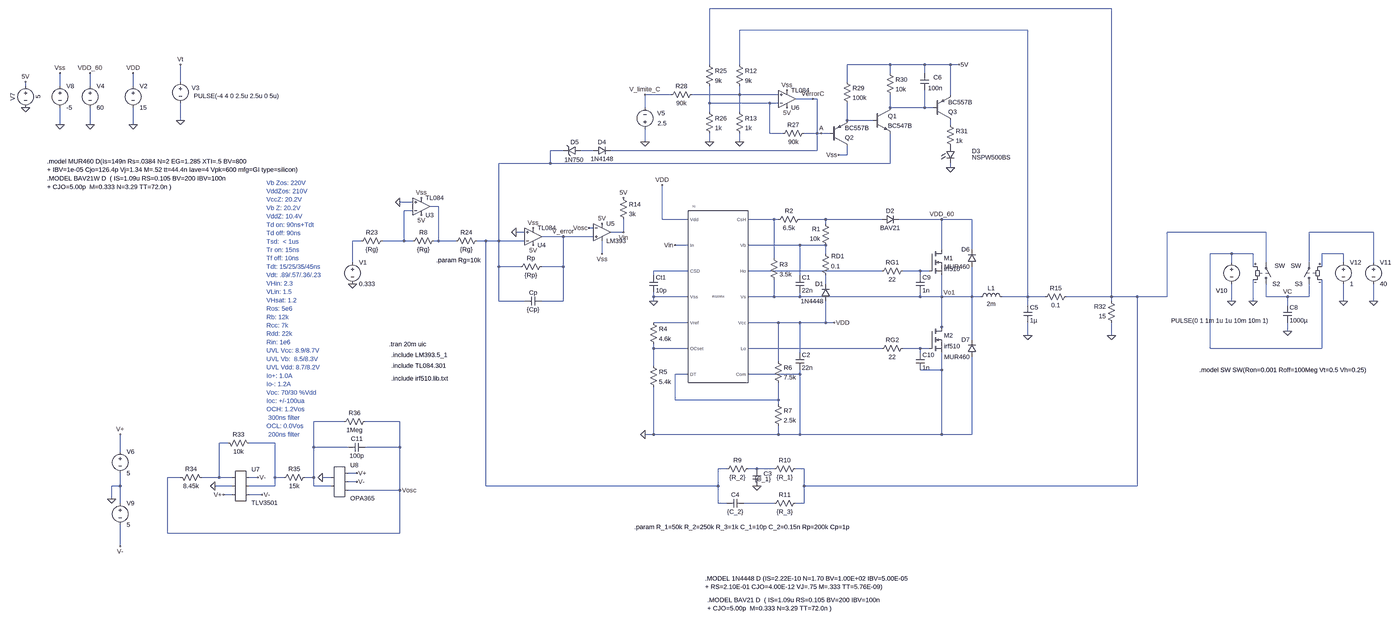
[diagram p0: schematic FINAL FILTRO_con_limitador.asc, whole sheet]
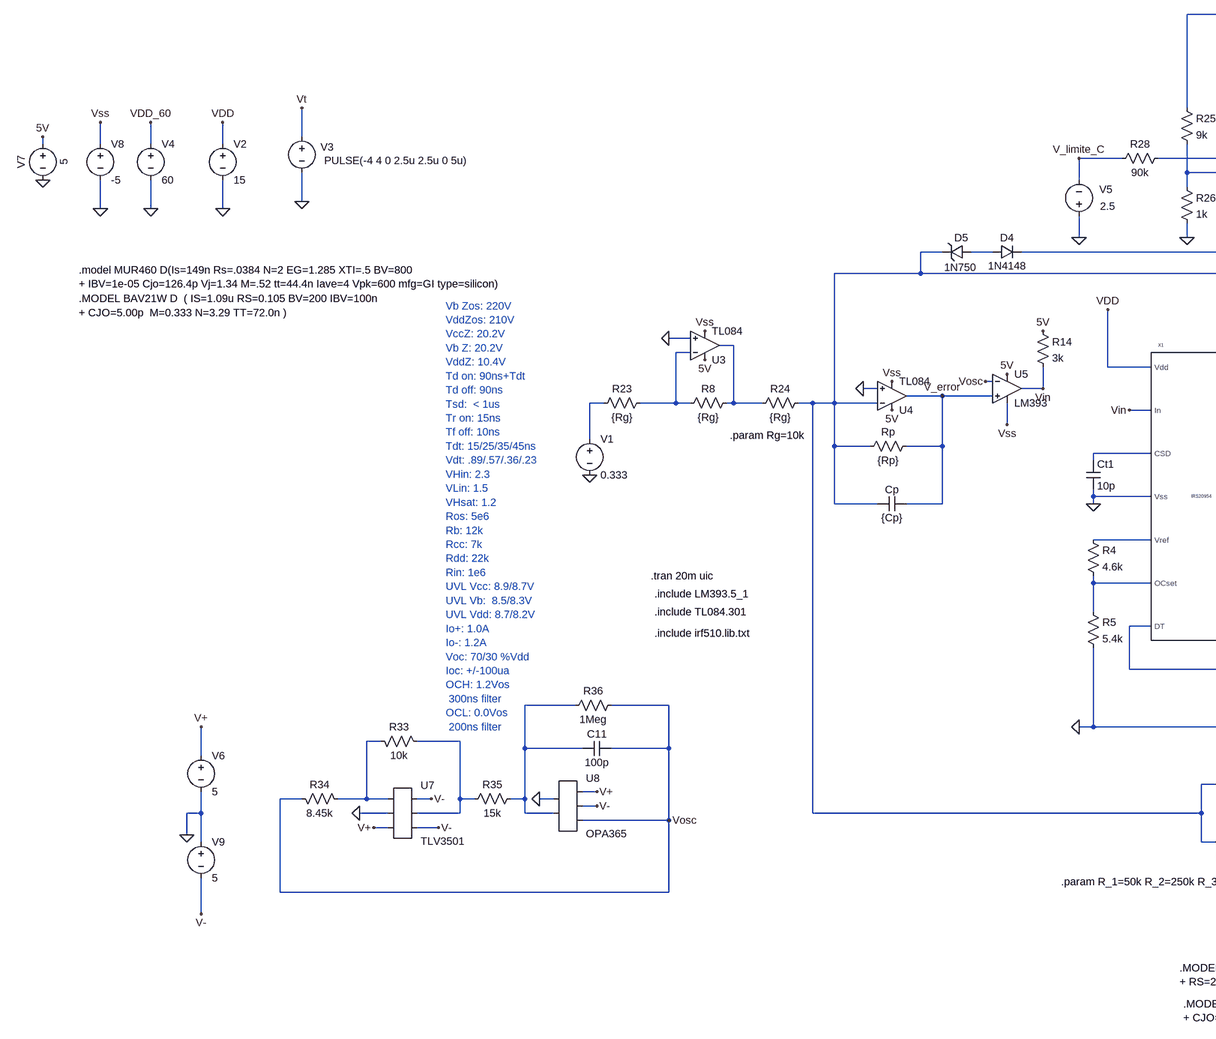
[diagram p1: schematic FINAL FILTRO_con_limitador.asc, part, row 1 of 1, column 1 of 2]
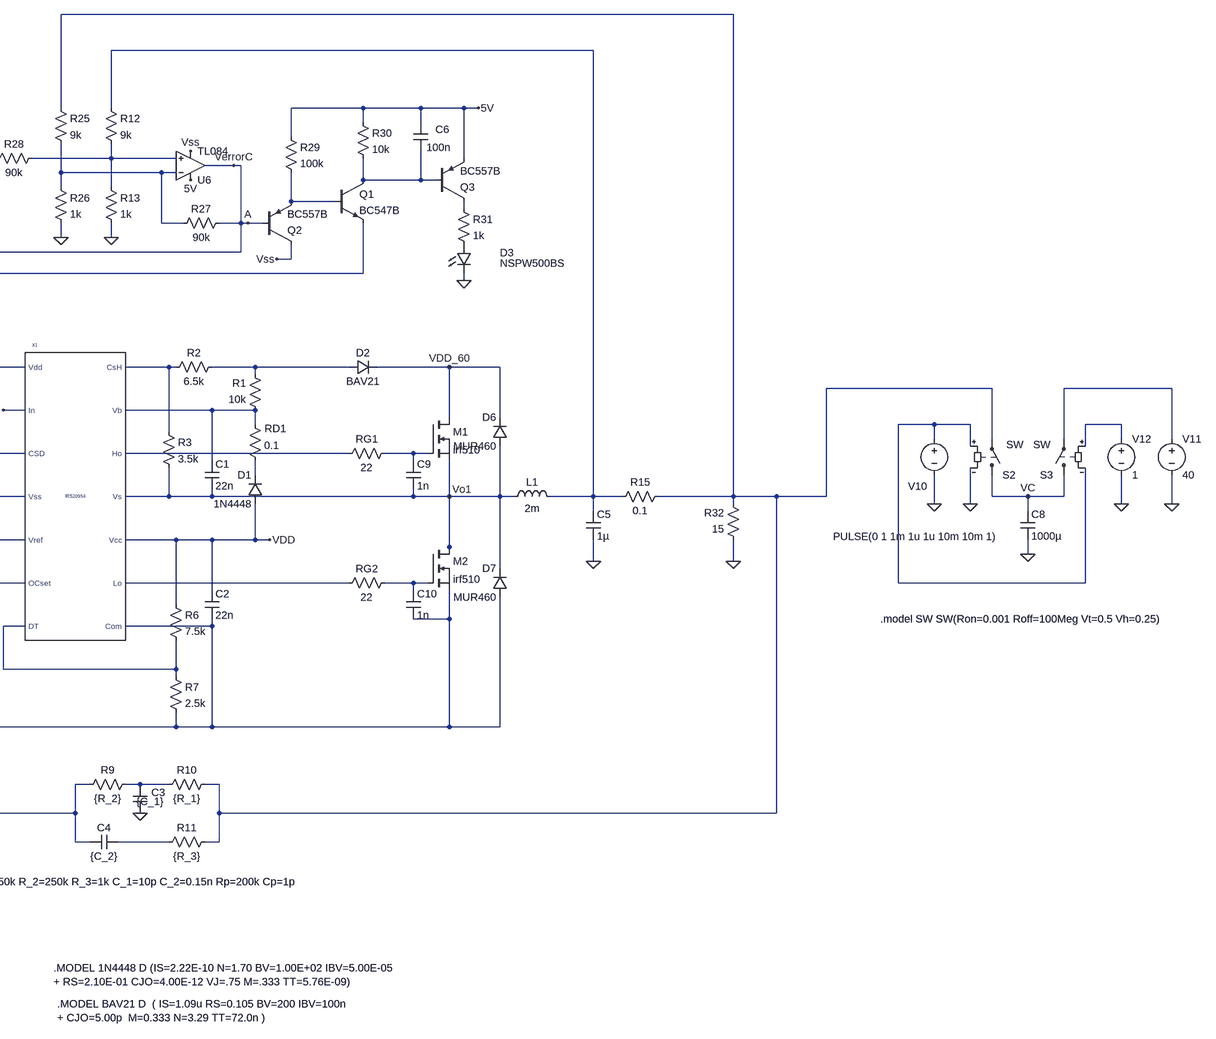
[diagram p2: schematic FINAL FILTRO_con_limitador.asc, part, row 1 of 1, column 2 of 2]
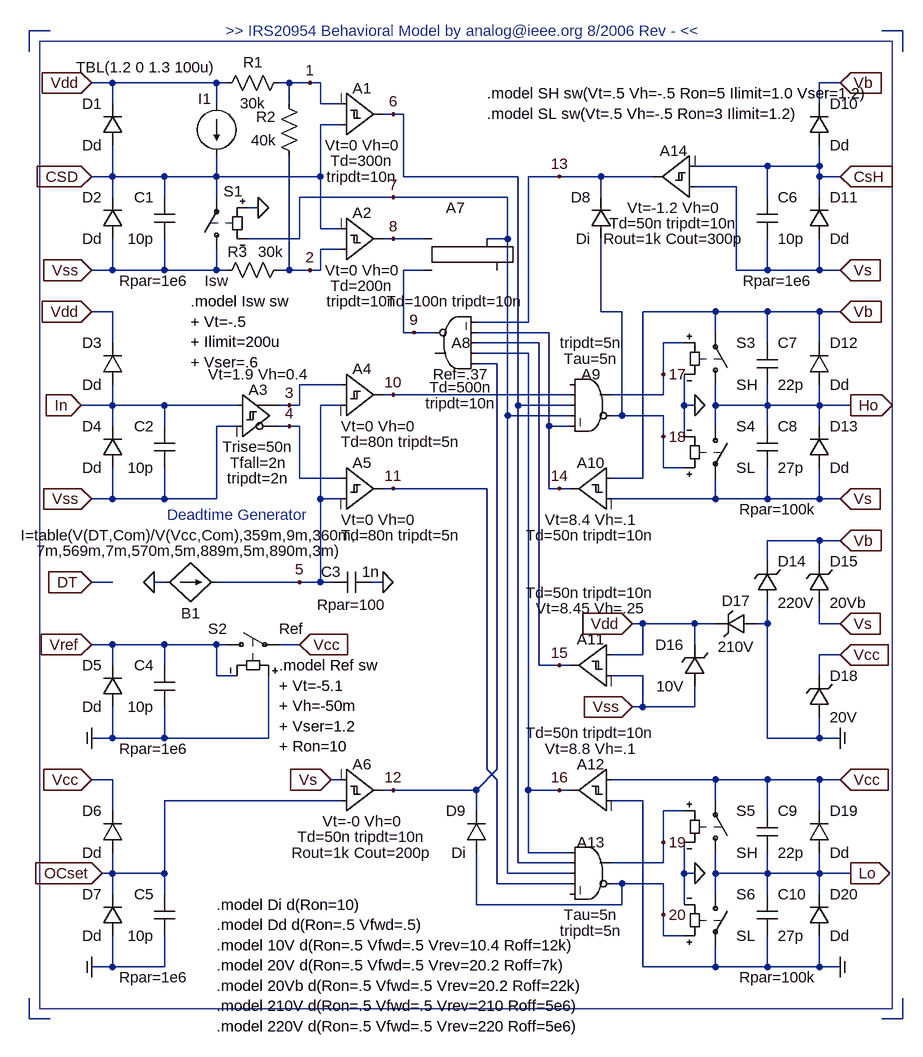
[diagram p3: sub-circuit irs20954.asc]
FINAL FILTRO_con_limitador.asc, the LTspice schematic file:
Version 4
SHEET 1 3216 2012
WIRE 1408 -736 -112 -736
WIRE 1072 -656 0 -656
WIRE -112 -528 -112 -736
WIRE 0 -528 0 -656
WIRE 560 -528 400 -528
WIRE 688 -528 560 -528
WIRE 784 -528 688 -528
WIRE 816 -528 784 -528
WIRE 560 -496 560 -528
WIRE 688 -496 688 -528
WIRE -2080 -464 -2080 -528
WIRE 400 -464 400 -528
WIRE -2656 -448 -2656 -464
WIRE -2528 -448 -2528 -496
WIRE -2416 -448 -2416 -496
WIRE -2256 -448 -2256 -496
WIRE -256 -416 -352 -416
WIRE 0 -416 0 -448
WIRE 0 -416 -176 -416
WIRE 144 -416 0 -416
WIRE 784 -416 784 -528
WIRE 272 -400 208 -400
WIRE 288 -400 272 -400
WIRE -112 -384 -112 -448
WIRE 112 -384 -112 -384
WIRE 144 -384 112 -384
WIRE -352 -368 -352 -416
WIRE 560 -368 560 -416
WIRE 688 -368 688 -432
WIRE 688 -368 560 -368
WIRE 720 -368 688 -368
WIRE -112 -352 -112 -384
WIRE 0 -352 0 -416
WIRE -2080 -320 -2080 -384
WIRE 400 -320 400 -384
WIRE 496 -320 400 -320
WIRE -2528 -304 -2528 -368
WIRE -2416 -304 -2416 -368
WIRE -2256 -304 -2256 -368
WIRE 784 -304 784 -320
WIRE 112 -272 112 -384
WIRE 160 -272 112 -272
WIRE 288 -272 288 -400
WIRE 288 -272 240 -272
WIRE 304 -272 288 -272
WIRE 336 -272 304 -272
WIRE -352 -240 -352 -288
WIRE -112 -240 -112 -272
WIRE 0 -240 0 -272
WIRE -656 -208 -704 -208
WIRE -544 -208 -592 -208
WIRE 288 -208 288 -272
WIRE 288 -208 -480 -208
WIRE 400 -192 400 -224
WIRE 400 -192 368 -192
WIRE -704 -160 -704 -208
WIRE -704 -160 -896 -160
WIRE 560 -160 560 -272
WIRE 560 -160 -704 -160
WIRE 784 -144 784 -160
WIRE -1216 -16 -1264 -16
WIRE -1120 0 -1152 0
WIRE -1216 16 -1248 16
WIRE -288 48 -288 -80
WIRE -192 48 -288 48
WIRE 128 48 32 48
WIRE 144 48 128 48
WIRE 320 48 224 48
WIRE 528 48 320 48
WIRE 752 48 592 48
WIRE 864 48 752 48
WIRE 320 64 320 48
WIRE -544 80 -560 80
WIRE -800 96 -832 96
WIRE -432 96 -432 48
WIRE -432 96 -480 96
WIRE 2128 96 1760 96
WIRE 2528 96 2288 96
WIRE -656 112 -736 112
WIRE -544 112 -656 112
WIRE -1408 128 -1440 128
WIRE -1248 128 -1248 16
WIRE -1248 128 -1328 128
WIRE -1216 128 -1248 128
WIRE -1120 128 -1120 0
WIRE -1120 128 -1136 128
WIRE -1056 128 -1120 128
WIRE -944 128 -976 128
WIRE -896 128 -896 -160
WIRE -896 128 -944 128
WIRE -800 128 -896 128
WIRE -192 144 -240 144
WIRE 224 144 32 144
WIRE 320 144 224 144
WIRE 752 160 752 48
WIRE 864 160 864 48
WIRE -512 176 -512 128
WIRE 320 176 320 144
WIRE 2000 176 1920 176
WIRE 2080 176 2000 176
WIRE 2416 176 2336 176
WIRE 128 192 128 48
WIRE -1440 208 -1440 128
WIRE 2000 208 2000 176
WIRE 2128 208 2128 96
WIRE 2288 208 2288 96
WIRE 2416 208 2416 176
WIRE 2528 208 2528 96
WIRE -896 224 -896 128
WIRE -816 224 -896 224
WIRE -656 224 -656 112
WIRE -656 224 -736 224
WIRE 2080 224 2080 176
WIRE 2336 224 2336 176
WIRE -192 240 -320 240
WIRE 528 240 32 240
WIRE 672 240 608 240
WIRE 704 240 672 240
WIRE -320 256 -320 240
WIRE 224 256 224 144
WIRE 672 256 672 240
WIRE 320 288 320 256
WIRE -320 336 -320 320
WIRE -192 336 -320 336
WIRE 128 336 128 272
WIRE 128 336 32 336
WIRE 224 336 224 320
WIRE 224 336 128 336
WIRE 672 336 672 320
WIRE 672 336 224 336
WIRE 752 336 752 256
WIRE 752 336 672 336
WIRE 864 336 864 224
WIRE 864 336 752 336
WIRE 896 336 864 336
WIRE 1072 336 1072 -656
WIRE 1072 336 976 336
WIRE 1136 336 1072 336
WIRE 1408 336 1408 -736
WIRE 1408 336 1216 336
WIRE 1504 336 1408 336
WIRE 1760 336 1760 96
WIRE 1760 336 1504 336
WIRE 2128 336 2128 288
WIRE 2208 336 2128 336
WIRE 2288 336 2288 288
WIRE 2288 336 2208 336
WIRE -896 352 -896 224
WIRE -800 352 -896 352
WIRE -656 352 -656 224
WIRE -656 352 -736 352
WIRE -320 352 -320 336
WIRE 1408 352 1408 336
WIRE 2000 352 2000 288
WIRE 2080 352 2080 272
WIRE 2416 352 2416 288
WIRE 2528 352 2528 288
WIRE 1072 368 1072 336
WIRE 2208 368 2208 336
WIRE -192 432 -320 432
WIRE 144 432 32 432
WIRE 224 432 144 432
WIRE 320 432 320 352
WIRE 320 432 224 432
WIRE 352 432 320 432
WIRE 752 448 752 336
WIRE 752 464 752 448
WIRE 2208 464 2208 432
WIRE 1072 480 1072 432
WIRE 1408 480 1408 432
WIRE 864 496 864 336
WIRE -320 528 -320 512
WIRE -192 528 -320 528
WIRE 528 528 32 528
WIRE 672 528 608 528
WIRE 704 528 672 528
WIRE 1920 528 1920 176
WIRE 2336 528 2336 272
WIRE 2336 528 1920 528
WIRE 224 544 224 432
WIRE 672 544 672 528
WIRE 144 576 144 432
WIRE -320 592 -320 528
WIRE 752 608 752 544
WIRE 752 608 672 608
WIRE -192 624 -240 624
WIRE 224 624 224 608
WIRE 224 624 32 624
WIRE -240 720 -240 624
WIRE 144 720 144 656
WIRE 144 720 -240 720
WIRE 144 736 144 720
WIRE -1472 800 -1584 800
WIRE -1264 800 -1392 800
WIRE -320 848 -320 672
WIRE -320 848 -352 848
WIRE 144 848 144 816
WIRE 144 848 -320 848
WIRE 224 848 224 624
WIRE 224 848 144 848
WIRE 752 848 752 608
WIRE 752 848 224 848
WIRE 864 848 864 560
WIRE 864 848 752 848
WIRE -1904 880 -1936 880
WIRE -1728 880 -1824 880
WIRE -1584 896 -1584 800
WIRE -1456 896 -1584 896
WIRE -1264 896 -1264 800
WIRE -1264 896 -1392 896
WIRE -2304 912 -2304 848
WIRE -48 976 -80 976
WIRE 64 976 32 976
WIRE 128 976 64 976
WIRE 240 976 208 976
WIRE -1424 992 -1456 992
WIRE -2080 1008 -2128 1008
WIRE -1936 1008 -1936 880
WIRE -1936 1008 -2000 1008
WIRE -1888 1008 -1936 1008
WIRE -1792 1008 -1824 1008
WIRE -1728 1008 -1728 880
WIRE -1696 1008 -1728 1008
WIRE -1584 1008 -1584 896
WIRE -1584 1008 -1616 1008
WIRE -1520 1008 -1552 1008
WIRE -1424 1024 -1456 1024
WIRE -2304 1040 -2304 992
WIRE -2304 1040 -2336 1040
WIRE -1888 1040 -1952 1040
WIRE -1728 1040 -1728 1008
WIRE -1728 1040 -1824 1040
WIRE -1584 1040 -1584 1008
WIRE -1520 1040 -1584 1040
WIRE -944 1040 -944 128
WIRE -80 1040 -80 976
WIRE -80 1040 -944 1040
WIRE 240 1040 240 976
WIRE 1504 1040 1504 336
WIRE 1504 1040 240 1040
WIRE -1264 1056 -1264 896
WIRE -1264 1056 -1456 1056
WIRE -1888 1072 -1920 1072
WIRE -1776 1072 -1824 1072
WIRE -2336 1088 -2336 1040
WIRE -2304 1104 -2304 1040
WIRE -80 1104 -80 1040
WIRE -48 1104 -80 1104
WIRE 128 1104 16 1104
WIRE 240 1104 240 1040
WIRE 240 1104 208 1104
WIRE -2128 1216 -2128 1008
WIRE -1264 1216 -1264 1056
WIRE -1264 1216 -2128 1216
WIRE -2304 1264 -2304 1184
FLAG -2416 -304 0
FLAG -2416 -496 VDD_60
FLAG -2256 -304 0
FLAG -2256 -496 VDD
FLAG 1072 480 0
FLAG -2656 -368 0
FLAG -2528 -304 0
FLAG -2528 -496 Vss
FLAG -2656 -464 5V
FLAG 64 1040 0
FLAG -656 112 V_error
FLAG -768 80 Vss
FLAG -768 144 5V
FLAG -432 96 Vin
FLAG -432 -32 5V
FLAG -512 176 Vss
FLAG -512 64 5V
FLAG -1264 -16 0
FLAG -1184 -32 Vss
FLAG -1184 32 5V
FLAG -352 848 0
FLAG 752 48 VDD_60
FLAG -288 -80 VDD
FLAG -320 352 0
FLAG 752 336 Vo1
FLAG -240 144 Vin
FLAG 352 432 VDD
FLAG -832 96 0
FLAG -1440 288 0
FLAG -2080 -320 0
FLAG -2080 -528 Vt
FLAG 0 -240 0
FLAG -112 -240 0
FLAG 272 -400 VerrorC
FLAG -352 -240 0
FLAG -352 -416 V_limite_C
FLAG 784 -144 0
FLAG 304 -272 A
FLAG 1408 480 0
FLAG 176 -432 Vss
FLAG 176 -368 5V
FLAG 816 -528 5V
FLAG 368 -192 Vss
FLAG 2080 352 0
FLAG 2000 352 0
FLAG 2208 464 0
FLAG 2528 352 0
FLAG 2416 352 0
FLAG 2208 336 VC
FLAG -2336 1088 0
FLAG -2304 848 V+
FLAG -2304 1264 V-
FLAG -1424 992 V+
FLAG -1920 1072 V+
FLAG -1424 1024 V-
FLAG -1952 1040 0
FLAG -1792 1008 V-
FLAG -1552 1008 0
FLAG -1776 1072 V-
FLAG -1264 1056 Vosc
FLAG -560 80 Vosc
SYMBOL voltage -2256 -464 R0
SYMATTR InstName V2
SYMATTR Value 15
SYMBOL voltage -2416 -464 R0
WINDOW 123 0 0 Left 2
WINDOW 39 0 0 Left 2
SYMATTR InstName V4
SYMATTR Value 60
SYMBOL ind 880 352 R270
WINDOW 0 32 56 VTop 2
WINDOW 3 5 56 VBottom 2
SYMATTR InstName L1
SYMATTR Value 2m
SYMBOL cap 1056 368 R0
SYMATTR InstName C5
SYMATTR Value 1µ
SYMBOL voltage -2656 -464 R0
WINDOW 0 -32 56 VBottom 2
WINDOW 3 32 56 VTop 2
WINDOW 123 0 0 Left 2
WINDOW 39 0 0 Left 2
SYMATTR InstName V7
SYMATTR Value 5
SYMBOL voltage -2528 -464 R0
WINDOW 123 0 0 Left 2
WINDOW 39 0 0 Left 2
SYMATTR InstName V8
SYMATTR Value -5
SYMBOL res 48 960 R90
WINDOW 0 0 56 VBottom 2
WINDOW 3 32 56 VTop 2
SYMATTR InstName R9
SYMATTR Value {R_2}
SYMBOL res 224 960 R90
WINDOW 0 0 56 VBottom 2
WINDOW 3 32 56 VTop 2
SYMATTR InstName R10
SYMATTR Value {R_1}
SYMBOL cap 80 1040 R180
WINDOW 0 -40 46 Left 2
WINDOW 3 -37 26 Left 2
SYMATTR InstName C3
SYMATTR Value {C_1}
SYMBOL cap 16 1088 R90
WINDOW 0 0 32 VBottom 2
WINDOW 3 32 32 VTop 2
SYMATTR InstName C4
SYMATTR Value {C_2}
SYMBOL res 224 1088 R90
WINDOW 0 0 56 VBottom 2
WINDOW 3 32 56 VTop 2
SYMATTR InstName R11
SYMATTR Value {R_3}
SYMBOL res -720 208 R90
WINDOW 0 0 56 VBottom 2
WINDOW 3 32 56 VTop 2
SYMATTR InstName Rp
SYMATTR Value {Rp}
SYMBOL cap -736 336 R90
WINDOW 0 0 32 VBottom 2
WINDOW 3 32 32 VTop 2
SYMATTR InstName Cp
SYMATTR Value {Cp}
SYMBOL opamp2 -768 176 M180
SYMATTR InstName U4
SYMATTR Value TL084
SYMBOL opamp2 -512 32 R0
SYMATTR InstName U5
SYMATTR Value LM393
SYMBOL res -448 -48 R0
SYMATTR InstName R14
SYMATTR Value 3k
SYMBOL res -1120 112 R90
WINDOW 0 0 56 VBottom 2
WINDOW 3 32 56 VTop 2
SYMATTR InstName R8
SYMATTR Value {Rg}
SYMBOL res -1312 112 R90
WINDOW 0 0 56 VBottom 2
WINDOW 3 32 56 VTop 2
SYMATTR InstName R23
SYMATTR Value {Rg}
SYMBOL res -960 112 R90
WINDOW 0 0 56 VBottom 2
WINDOW 3 32 56 VTop 2
SYMATTR InstName R24
SYMATTR Value {Rg}
SYMBOL opamp2 -1184 64 M180
SYMATTR InstName U3
SYMATTR Value TL084
SYMBOL cap 208 256 R0
SYMATTR InstName C1
SYMATTR Value 22n
SYMBOL cap -336 256 R0
SYMATTR InstName Ct1
SYMATTR Value 10p
SYMBOL cap 208 544 R0
SYMATTR InstName C2
SYMATTR Value 22n
SYMBOL nmos 704 160 R0
SYMATTR InstName M1
SYMATTR Value irf510
SYMATTR Prefix X
SYMBOL nmos 704 448 R0
SYMATTR InstName M2
SYMATTR Value irf510
SYMATTR Prefix X
SYMBOL res 304 160 R0
WINDOW 0 37 25 Left 2
WINDOW 3 36 62 Left 2
SYMATTR InstName RD1
SYMATTR Value 0.1
SYMBOL res 624 224 R90
WINDOW 0 0 56 VBottom 2
WINDOW 3 32 56 VTop 2
SYMATTR InstName RG1
SYMATTR Value 22
SYMBOL res 624 512 R90
WINDOW 0 0 56 VBottom 2
WINDOW 3 32 56 VTop 2
SYMATTR InstName RG2
SYMATTR Value 22
SYMBOL res 112 176 R0
SYMATTR InstName R3
SYMATTR Value 3.5k
SYMBOL res 240 32 R90
WINDOW 0 0 56 VBottom 2
WINDOW 3 32 56 VTop 2
SYMATTR InstName R2
SYMATTR Value 6.5k
SYMBOL res 336 160 R180
WINDOW 0 36 76 Left 2
WINDOW 3 36 40 Left 2
SYMATTR InstName R1
SYMATTR Value 10k
SYMBOL res -336 576 R0
SYMATTR InstName R5
SYMATTR Value 5.4k
SYMBOL res -336 416 R0
SYMATTR InstName R4
SYMATTR Value 4.6k
SYMBOL IRS20954 -80 336 R0
SYMATTR InstName X1
SYMBOL voltage -1440 192 R0
WINDOW 123 0 0 Left 2
WINDOW 39 0 0 Left 2
SYMATTR InstName V1
SYMATTR Value 0.333
SYMBOL voltage -2080 -480 R0
WINDOW 123 0 0 Left 2
WINDOW 39 0 0 Left 2
WINDOW 3 369 69 Right 2
WINDOW 0 42 39 Left 2
SYMATTR Value PULSE(-4 4 0 2.5u 2.5u 0 5u)
SYMATTR InstName V3
SYMBOL res -16 -544 R0
SYMATTR InstName R12
SYMATTR Value 9k
SYMBOL res -16 -368 R0
SYMATTR InstName R13
SYMATTR Value 1k
SYMBOL res -128 -544 R0
SYMATTR InstName R25
SYMATTR Value 9k
SYMBOL res -128 -368 R0
SYMATTR InstName R26
SYMATTR Value 1k
SYMBOL res 256 -288 R90
WINDOW 0 0 56 VBottom 2
WINDOW 3 32 56 VTop 2
SYMATTR InstName R27
SYMATTR Value 90k
SYMBOL res -160 -432 R90
WINDOW 0 0 56 VBottom 2
WINDOW 3 32 56 VTop 2
SYMATTR InstName R28
SYMATTR Value 90k
SYMBOL voltage -352 -272 R180
WINDOW 0 -75 75 Left 2
WINDOW 3 -81 37 Left 2
WINDOW 123 0 0 Left 2
WINDOW 39 0 0 Left 2
SYMATTR InstName V5
SYMATTR Value 2.5
SYMBOL npn 496 -368 R0
SYMATTR InstName Q1
SYMATTR Value BC547B
SYMBOL pnp 336 -224 M180
SYMATTR InstName Q2
SYMATTR Value BC557B
SYMBOL res 384 -480 R0
SYMATTR InstName R29
SYMATTR Value 100k
SYMBOL LED 768 -224 R0
WINDOW 0 96 18 Left 2
WINDOW 3 96 41 Left 2
SYMATTR InstName D3
SYMATTR Value NSPW500BS
SYMBOL res 544 -512 R0
SYMATTR InstName R30
SYMATTR Value 10k
SYMBOL pnp 720 -320 M180
SYMATTR InstName Q3
SYMATTR Value BC557B
SYMBOL res 768 -320 R0
SYMATTR InstName R31
SYMATTR Value 1k
SYMBOL cap 704 -432 R180
WINDOW 0 -48 48 Left 2
WINDOW 3 -51 8 Left 2
SYMATTR InstName C6
SYMATTR Value 100n
SYMBOL diode -544 -192 R270
WINDOW 0 32 32 VTop 2
WINDOW 3 0 32 VBottom 2
SYMATTR InstName D4
SYMATTR Value 1N4148
SYMBOL zener -592 -224 R90
WINDOW 0 0 22 VBottom 2
WINDOW 3 35 24 VTop 2
SYMATTR InstName D5
SYMATTR Value 1N750
SYMATTR Description Diode
SYMATTR Type diode
SYMBOL res 1424 448 R180
WINDOW 0 36 76 Left 2
WINDOW 3 36 40 Left 2
SYMATTR InstName R32
SYMATTR Value 15
SYMBOL res 1232 320 R90
WINDOW 0 0 56 VBottom 2
WINDOW 3 32 56 VTop 2
SYMATTR InstName R15
SYMATTR Value 0.1
SYMBOL opamp2 176 -336 M180
SYMATTR InstName U6
SYMATTR Value TL084
SYMBOL diode 880 224 R180
WINDOW 0 24 64 Left 2
WINDOW 3 24 0 Left 2
SYMATTR InstName D6
SYMATTR Value MUR460
SYMBOL diode 880 560 R180
WINDOW 0 24 64 Left 2
WINDOW 3 24 0 Left 2
SYMATTR InstName D7
SYMATTR Value MUR460
SYMBOL sw 2128 304 M180
WINDOW 3 32 83 Left 2
SYMATTR InstName S2
SYMBOL voltage 2000 192 R0
WINDOW 3 -225 233 Left 2
WINDOW 123 0 0 Left 2
WINDOW 39 0 0 Left 2
WINDOW 0 -58 121 Left 2
SYMATTR Value PULSE(0 1 1m 1u 1u 10m 10m 1)
SYMATTR InstName V10
SYMBOL voltage 2528 192 R0
WINDOW 123 0 0 Left 2
WINDOW 39 0 0 Left 2
SYMATTR InstName V11
SYMATTR Value 40
SYMBOL sw 2288 304 R180
WINDOW 3 30 83 Left 2
SYMATTR InstName S3
SYMBOL voltage 2416 192 R0
SYMATTR InstName V12
SYMATTR Value 1
SYMBOL cap 2192 368 R0
SYMATTR InstName C8
SYMATTR Value 1000µ
SYMBOL diode 528 64 R270
WINDOW 0 32 32 VTop 2
WINDOW 3 0 32 VBottom 2
SYMATTR InstName D2
SYMATTR Value BAV21
SYMBOL cap 656 256 R0
SYMATTR InstName C9
SYMATTR Value 1n
SYMBOL cap 656 544 R0
SYMATTR InstName C10
SYMATTR Value 1n
SYMBOL diode 336 352 R180
WINDOW 0 24 64 Left 2
WINDOW 3 24 0 Left 2
SYMATTR InstName D1
SYMATTR Value 1N4448
SYMBOL res 128 720 R0
SYMATTR InstName R7
SYMATTR Value 2.5k
SYMBOL res 128 560 R0
SYMATTR InstName R6
SYMATTR Value 7.5k
SYMBOL voltage -2304 896 R0
WINDOW 123 0 0 Left 2
WINDOW 39 0 0 Left 2
SYMATTR InstName V6
SYMATTR Value 5
SYMBOL voltage -2304 1088 R0
WINDOW 123 0 0 Left 2
WINDOW 39 0 0 Left 2
SYMATTR InstName V9
SYMATTR Value 5
SYMBOL res -1808 896 M270
WINDOW 0 32 56 VTop 2
WINDOW 3 0 56 VBottom 2
SYMATTR InstName R33
SYMATTR Value 10k
SYMBOL res -1984 1024 M270
WINDOW 0 32 56 VTop 2
WINDOW 3 0 56 VBottom 2
SYMATTR InstName R34
SYMATTR Value 8.45k
SYMBOL cap -1392 880 R90
WINDOW 0 0 32 VBottom 2
WINDOW 3 32 32 VTop 2
SYMATTR InstName C11
SYMATTR Value 100p
SYMBOL res -1600 992 R90
WINDOW 0 0 56 VBottom 2
WINDOW 3 32 56 VTop 2
SYMATTR InstName R35
SYMATTR Value 15k
SYMBOL res -1376 784 R90
WINDOW 0 0 56 VBottom 2
WINDOW 3 32 56 VTop 2
SYMATTR InstName R36
SYMATTR Value 1Meg
SYMBOL AutoGenerated/TLV3501 -1856 1040 R0
SYMATTR InstName U7
SYMBOL AutoGenerated/OPA365 -1488 1024 R0
SYMATTR InstName U8
TEXT -1760 -88 Left 2 ;Vb Zos: 220V\nVddZos: 210V\nVccZ: 20.2V\nVb Z: 20.2V\nVddZ: 10.4V\nTd on: 90ns+Tdt\nTd off: 90ns\nTsd:  < 1us\nTr on: 15ns\nTf off: 10ns\nTdt: 15/25/35/45ns\nVdt: .89/.57/.36/.23\nVHin: 2.3\nVLin: 1.5\nVHsat: 1.2\nRos: 5e6\nRb: 12k\nRcc: 7k\nRdd: 22k\nRin: 1e6\nUVL Vcc: 8.9/8.7V\nUVL Vb:  8.5/8.3V\nUVL Vdd: 8.7/8.2V\nIo+: 1.0A\nIo-: 1.2A\nVoc: 70/30 %Vdd\nIoc: +/-100ua\nOCH: 1.2Vos\n 300ns filter\nOCL: 0.0Vos\n 200ns filter
TEXT -1304 512 Left 2 !.tran 20m uic
TEXT -2576 -168 Left 2 !.model MUR460 D(Is=149n Rs=.0384 N=2 EG=1.285 XTI=.5 BV=800 \n+ IBV=1e-05 Cjo=126.4p Vj=1.34 M=.52 tt=44.4n Iave=4 Vpk=600 mfg=GI type=silicon)
TEXT -2576 -104 Left 2 !.MODEL BAV21W D  ( IS=1.09u RS=0.105 BV=200 IBV=100n\n+ CJO=5.00p  M=0.333 N=3.29 TT=72.0n )
TEXT -1296 552 Left 2 !.include LM393.5_1
TEXT -1296 592 Left 2 !.include TL084.301
TEXT -1128 200 Left 2 !.param Rg=10k
TEXT -392 1192 Left 2 !.param R_1=50k R_2=250k R_3=1k C_1=10p C_2=0.15n Rp=200k Cp=1p
TEXT 1880 608 Left 2 !.model SW SW(Ron=0.001 Roff=100Meg Vt=0.5 Vh=0.25)
TEXT -120 1464 Left 2 !.MODEL BAV21 D  ( IS=1.09u RS=0.105 BV=200 IBV=100n\n+ CJO=5.00p  M=0.333 N=3.29 TT=72.0n )
TEXT -128 1384 Left 2 !.MODEL 1N4448 D (IS=2.22E-10 N=1.70 BV=1.00E+02 IBV=5.00E-05\n+ RS=2.10E-01 CJO=4.00E-12 VJ=.75 M=.333 TT=5.76E-09)
TEXT -1296 640 Left 2 !.include irf510.lib.txt

irs20954.asc, the sub-circuit schematic file:
Version 4
SHEET 1 13828 1048
WIRE -480 -576 -512 -576
WIRE 832 -576 800 -576
WIRE -512 -544 -512 -576
WIRE 832 -544 832 -576
WIRE -384 -496 -416 -496
WIRE -224 -496 -384 -496
WIRE -208 -496 -224 -496
WIRE -112 -496 -128 -496
WIRE -80 -496 -112 -496
WIRE -64 -496 -80 -496
WIRE 736 -496 704 -496
WIRE -384 -464 -384 -496
WIRE -224 -464 -224 -496
WIRE -112 -464 -112 -496
WIRE -64 -464 -64 -496
WIRE -32 -464 -64 -464
WIRE 704 -464 704 -496
WIRE 48 -448 32 -448
WIRE 64 -448 48 -448
WIRE -32 -432 -64 -432
WIRE 624 -368 512 -368
WIRE 704 -368 704 -400
WIRE 704 -368 624 -368
WIRE -384 -352 -384 -400
WIRE -384 -352 -416 -352
WIRE -304 -352 -384 -352
WIRE -224 -352 -224 -384
WIRE -224 -352 -304 -352
WIRE -64 -352 -64 -432
WIRE -64 -352 -224 -352
WIRE 64 -352 64 -448
WIRE 240 -352 64 -352
WIRE 304 -352 256 -352
WIRE 368 -352 304 -352
WIRE 448 -352 368 -352
WIRE 704 -352 704 -368
WIRE 736 -352 704 -352
WIRE 576 -336 512 -336
WIRE -384 -320 -384 -352
WIRE -304 -320 -304 -352
WIRE -224 -320 -224 -352
WIRE 48 -320 -96 -320
WIRE 224 -320 48 -320
WIRE 368 -320 368 -352
WIRE 624 -320 624 -368
WIRE 704 -320 704 -352
WIRE -160 -304 -176 -304
WIRE -64 -272 -64 -352
WIRE -32 -272 -64 -272
WIRE -96 -256 -96 -320
WIRE -96 -256 -176 -256
WIRE 48 -256 32 -256
WIRE 96 -256 48 -256
WIRE 224 -256 224 -320
WIRE 224 -256 192 -256
WIRE -32 -240 -64 -240
WIRE -384 -208 -384 -256
WIRE -384 -208 -416 -208
WIRE -304 -208 -304 -256
WIRE -304 -208 -384 -208
WIRE -224 -208 -224 -240
WIRE -224 -208 -304 -208
WIRE -208 -208 -224 -208
WIRE -112 -208 -112 -384
WIRE -112 -208 -128 -208
WIRE -80 -208 -112 -208
WIRE -64 -208 -64 -240
WIRE -64 -208 -80 -208
WIRE 96 -208 64 -208
WIRE 576 -208 576 -336
WIRE 624 -208 624 -256
WIRE 624 -208 576 -208
WIRE 704 -208 704 -256
WIRE 704 -208 624 -208
WIRE 736 -208 704 -208
WIRE -384 -144 -416 -144
WIRE 368 -144 368 -256
WIRE 400 -144 368 -144
WIRE 544 -144 432 -144
WIRE 624 -144 544 -144
WIRE 704 -144 624 -144
WIRE 736 -144 704 -144
WIRE 256 -128 256 -352
WIRE 256 -128 176 -128
WIRE 64 -112 64 -208
WIRE 80 -112 64 -112
WIRE 112 -112 80 -112
WIRE 288 -112 176 -112
WIRE 544 -112 544 -144
WIRE -384 -96 -384 -144
WIRE 272 -96 176 -96
WIRE 496 -96 464 -96
WIRE 624 -96 624 -144
WIRE 704 -96 704 -144
WIRE 256 -80 176 -80
WIRE 208 -64 176 -64
WIRE 464 -48 464 -96
WIRE -32 -32 -96 -32
WIRE 48 -16 32 -16
WIRE 320 -16 48 -16
WIRE 464 -16 464 -48
WIRE 464 -16 384 -16
WIRE -384 0 -384 -32
WIRE -384 0 -432 0
WIRE -304 0 -384 0
WIRE -192 0 -304 0
WIRE -112 0 -128 0
WIRE -96 0 -96 -32
WIRE -96 0 -112 0
WIRE -32 0 -64 0
WIRE 240 0 240 -352
WIRE 320 0 240 0
WIRE 496 0 496 -48
WIRE 512 0 496 0
WIRE 544 0 544 -32
WIRE 624 0 624 -32
WIRE 624 0 544 0
WIRE 704 0 704 -32
WIRE 704 0 624 0
WIRE 752 0 704 0
WIRE 224 16 224 -256
WIRE 320 16 224 16
WIRE 400 16 400 -144
WIRE 400 16 384 16
WIRE 464 16 400 16
WIRE -384 32 -384 0
WIRE -304 32 -304 0
WIRE -192 32 -224 32
WIRE -112 32 -128 32
WIRE -96 32 -112 32
WIRE 288 32 288 -112
WIRE 320 32 288 32
WIRE 544 32 544 0
WIRE 624 32 624 0
WIRE 704 32 704 0
WIRE 464 48 464 16
WIRE 496 48 496 0
WIRE 464 96 464 48
WIRE 496 96 464 96
WIRE -96 112 -96 32
WIRE -32 112 -96 112
WIRE 432 112 432 -144
WIRE 432 112 384 112
WIRE 48 128 32 128
WIRE 192 128 48 128
WIRE 288 128 288 32
WIRE 304 128 288 128
WIRE 320 128 304 128
WIRE -384 144 -384 96
WIRE -384 144 -416 144
WIRE -304 144 -304 96
WIRE -304 144 -384 144
WIRE -224 144 -224 32
WIRE -224 144 -304 144
WIRE -64 144 -64 0
WIRE -32 144 -64 144
WIRE 544 144 544 112
WIRE 544 144 384 144
WIRE 624 144 624 96
WIRE 624 144 544 144
WIRE 704 144 704 96
WIRE 704 144 624 144
WIRE 736 144 704 144
WIRE 704 208 624 208
WIRE 736 208 704 208
WIRE 624 240 624 208
WIRE 704 240 704 208
WIRE -384 272 -416 272
WIRE -304 272 -320 272
WIRE -96 272 -224 272
WIRE -64 272 -64 144
WIRE -64 272 -96 272
WIRE -48 272 -64 272
WIRE 32 272 16 272
WIRE 432 336 416 336
WIRE 512 336 432 336
WIRE 544 336 512 336
WIRE 624 336 624 304
WIRE 624 336 608 336
WIRE 704 336 704 304
WIRE 736 336 704 336
WIRE -384 368 -416 368
WIRE -304 368 -384 368
WIRE -224 368 -304 368
WIRE -208 368 -224 368
WIRE -96 368 -128 368
WIRE 512 368 512 336
WIRE 432 384 432 336
WIRE 432 384 384 384
WIRE 736 384 704 384
WIRE -384 400 -384 368
WIRE -304 400 -304 368
WIRE 272 400 272 -96
WIRE 304 400 272 400
WIRE 320 400 304 400
WIRE -224 416 -224 368
WIRE -192 416 -224 416
WIRE 432 416 384 416
WIRE 704 416 704 384
WIRE 432 464 432 416
WIRE 432 464 416 464
WIRE 512 464 512 432
WIRE 512 464 432 464
WIRE -384 512 -384 464
WIRE -384 512 -416 512
WIRE -304 512 -304 464
WIRE -304 512 -384 512
WIRE -144 512 -144 416
WIRE -144 512 -304 512
WIRE 624 512 624 336
WIRE 704 512 704 480
WIRE 704 512 624 512
WIRE 736 512 704 512
WIRE 192 560 192 128
WIRE 208 560 208 -64
WIRE -384 576 -416 576
WIRE -32 576 -48 576
WIRE 208 576 192 560
WIRE 544 576 384 576
WIRE 624 576 544 576
WIRE 704 576 624 576
WIRE 736 576 704 576
WIRE 48 592 32 592
WIRE 176 592 208 560
WIRE 176 592 48 592
WIRE 256 592 256 -80
WIRE 304 592 256 592
WIRE 320 592 304 592
WIRE -32 608 -304 608
WIRE 432 608 384 608
WIRE 544 608 544 576
WIRE -384 624 -384 576
WIRE 176 624 176 592
WIRE 496 624 464 624
WIRE 624 624 624 576
WIRE 704 624 704 576
WIRE 464 672 464 624
WIRE 256 688 256 592
WIRE 320 688 256 688
WIRE 240 704 240 0
WIRE 320 704 240 704
WIRE 464 704 464 672
WIRE 464 704 384 704
WIRE -384 720 -384 688
WIRE -384 720 -400 720
WIRE -304 720 -304 608
WIRE -304 720 -384 720
WIRE 224 720 224 16
WIRE 320 720 224 720
WIRE 496 720 496 672
WIRE 512 720 496 720
WIRE 544 720 544 688
WIRE 624 720 624 688
WIRE 624 720 544 720
WIRE 704 720 704 688
WIRE 704 720 624 720
WIRE 752 720 704 720
WIRE 208 736 208 576
WIRE 320 736 208 736
WIRE 400 736 384 736
WIRE 464 736 400 736
WIRE -384 752 -384 720
WIRE -304 752 -304 720
WIRE 544 752 544 720
WIRE 624 752 624 720
WIRE 704 752 704 720
WIRE 176 768 176 688
WIRE 400 768 400 736
WIRE 400 768 176 768
WIRE 496 768 496 720
WIRE 464 784 464 736
WIRE 464 816 464 784
WIRE 496 816 464 816
WIRE -384 864 -384 816
WIRE -384 864 -416 864
WIRE -304 864 -304 816
WIRE -304 864 -384 864
WIRE 432 864 432 608
WIRE 544 864 544 832
WIRE 544 864 432 864
WIRE 624 864 624 816
WIRE 624 864 544 864
WIRE 704 864 704 816
WIRE 704 864 624 864
WIRE 736 864 704 864
WIRE -512 944 -512 912
WIRE -480 944 -512 944
WIRE 832 944 832 912
WIRE 832 944 800 944
FLAG 752 0 Ho
IOPIN 752 0 Out
FLAG -432 0 In
IOPIN -432 0 In
FLAG -416 -144 Vdd
IOPIN -416 -144 In
FLAG 736 -144 Vb
IOPIN 736 -144 In
FLAG 736 144 Vs
IOPIN 736 144 In
FLAG -416 144 Vss
IOPIN -416 144 In
FLAG 736 512 Com
IOPIN 736 512 In
FLAG 736 576 Vcc
IOPIN 736 576 In
FLAG 736 864 Com
IOPIN 736 864 In
FLAG 752 720 Lo
IOPIN 752 720 Out
FLAG -96 272 5
FLAG 512 720 0
FLAG 512 0 0
FLAG 80 -112 9
FLAG 464 -48 17
FLAG 464 48 18
FLAG 736 384 Vcc
IOPIN 736 384 In
FLAG 736 208 Vb
IOPIN 736 208 In
FLAG 736 336 Vs
IOPIN 736 336 In
FLAG -112 0 3
FLAG 304 -352 13
FLAG 304 128 14
FLAG -112 32 4
FLAG 48 -16 10
FLAG -400 720 OCset
IOPIN -400 720 In
FLAG 32 272 0
FLAG -320 272 0
FLAG -416 272 DT
IOPIN -416 272 In
FLAG 464 672 19
FLAG 464 784 20
FLAG 416 464 Vss
IOPIN 416 464 In
FLAG 416 336 Vdd
IOPIN 416 336 In
FLAG 736 -352 CsH
IOPIN 736 -352 In
FLAG 736 -496 Vb
IOPIN 736 -496 In
FLAG 736 -208 Vs
IOPIN 736 -208 In
FLAG -416 -352 CSD
IOPIN -416 -352 In
FLAG -416 -496 Vdd
IOPIN -416 -496 In
FLAG -416 -208 Vss
IOPIN -416 -208 In
FLAG -160 -304 0
FLAG -416 368 Vref
IOPIN -416 368 In
FLAG -48 576 Vs
IOPIN -48 576 In
FLAG -416 576 Vcc
IOPIN -416 576 In
FLAG -416 864 Com
IOPIN -416 864 In
FLAG -80 -496 1
FLAG -80 -208 2
FLAG 48 128 11
FLAG 48 -448 6
FLAG 48 -320 7
FLAG 48 -256 8
FLAG 48 592 12
FLAG 304 400 15
FLAG 304 592 16
FLAG -96 368 Vcc
IOPIN -96 368 In
FLAG -416 512 Com
IOPIN -416 512 In
SYMBOL diode -368 -400 R180
WINDOW 0 32 64 Left 0
WINDOW 3 32 0 Left 0
SYMATTR InstName D1
SYMATTR Value Dd
SYMBOL diode -368 -256 R180
WINDOW 0 32 64 Left 0
WINDOW 3 32 0 Left 0
SYMATTR InstName D2
SYMATTR Value Dd
SYMBOL cap -288 -320 M0
WINDOW 0 32 0 Left 0
WINDOW 3 32 64 Left 0
WINDOW 39 32 128 Center 0
SYMATTR InstName C1
SYMATTR Value 10p
SYMATTR SpiceLine Rpar=1e6
SYMBOL current -224 -464 R0
WINDOW 123 0 0 Left 0
WINDOW 39 0 0 Left 0
WINDOW 3 0 -56 Right 0
WINDOW 0 -8 -8 Right 0
SYMATTR Value TBL(1.2 0 1.3 100u)
SYMATTR InstName I1
SYMBOL sw -224 -224 R180
WINDOW 0 -11 105 Right 0
WINDOW 3 0 -32 Center 0
SYMATTR InstName S1
SYMATTR Value Isw
SYMBOL res -224 -480 R270
WINDOW 0 32 56 VTop 0
WINDOW 3 0 56 VBottom 0
SYMATTR InstName R1
SYMATTR Value 30k
SYMBOL res -96 -368 R180
WINDOW 0 36 76 Left 0
WINDOW 3 36 40 Left 0
SYMATTR InstName R2
SYMATTR Value 40k
SYMBOL res -112 -224 R90
WINDOW 0 -12 64 VRight 0
WINDOW 3 -12 48 VLeft 0
SYMATTR InstName R3
SYMATTR Value 30k
SYMBOL Digital\\diffschmtbuf -32 -384 M180
WINDOW 0 32 104 Center 0
WINDOW 3 32 16 Center 0
WINDOW 123 32 -8 Center 0
WINDOW 39 32 -32 Center 0
SYMATTR InstName A1
SYMATTR Value Vt=0 Vh=0
SYMATTR Value2 Td=300n
SYMATTR SpiceLine tripdt=10n
SYMBOL Digital\\diffschmtbuf -32 -192 M180
WINDOW 0 32 104 Center 0
WINDOW 3 32 16 Center 0
WINDOW 123 32 -8 Center 0
WINDOW 39 32 -32 Center 0
SYMATTR InstName A2
SYMATTR Value Vt=0 Vh=0
SYMATTR Value2 Td=200n
SYMATTR SpiceLine tripdt=10n
SYMBOL diode -368 -32 R180
WINDOW 0 32 64 Left 0
WINDOW 3 32 0 Left 0
SYMATTR InstName D3
SYMATTR Value Dd
SYMBOL diode -368 96 R180
WINDOW 0 32 64 Left 0
WINDOW 3 32 0 Left 0
SYMATTR InstName D4
SYMATTR Value Dd
SYMBOL cap -288 32 M0
WINDOW 0 32 0 Left 0
WINDOW 3 32 64 Left 0
SYMATTR InstName C2
SYMATTR Value 10p
SYMBOL Digital\\diffschmitt -192 -48 R0
WINDOW 0 32 24 Center 0
WINDOW 3 32 0 Center 0
WINDOW 123 32 112 Center 0
WINDOW 39 32 136 Center 0
WINDOW 40 32 160 Center 0
SYMATTR InstName A3
SYMATTR Value Vt=1.9 Vh=0.4
SYMATTR Value2 Trise=50n
SYMATTR SpiceLine Tfall=2n
SYMATTR SpiceLine2 tripdt=2n
SYMBOL Digital\\diffschmtbuf -32 -80 R0
WINDOW 0 32 24 Center 0
WINDOW 3 0 112 Left 0
WINDOW 123 0 136 Left 0
SYMATTR InstName A4
SYMATTR Value Vt=0 Vh=0
SYMATTR Value2 Td=80n tripdt=5n
SYMBOL Digital\\diffschmtbuf -32 64 R0
WINDOW 0 32 24 Center 0
WINDOW 3 0 112 Left 0
WINDOW 123 0 136 Left 0
SYMATTR InstName A5
SYMATTR Value Vt=0 Vh=0
SYMATTR Value2 Td=80n tripdt=5n
SYMBOL bi -304 272 R270
WINDOW 0 -48 40 VCenter 0
WINDOW 3 72 40 VCenter 0
WINDOW 123 48 40 VCenter 0
SYMATTR InstName B1
SYMATTR Value I=table(V(DT,Com)/V(Vcc,Com),359m,9m,360m,
SYMATTR Value2 7m,569m,7m,570m,5m,889m,5m,890m,3m)
SYMBOL cap -48 256 M90
WINDOW 0 0 16 VLeft 0
WINDOW 3 0 48 VRight 0
WINDOW 39 35 32 VTop 0
SYMATTR InstName C3
SYMATTR Value 1n
SYMATTR SpiceLine Rpar=100
SYMBOL sw -224 368 R270
WINDOW 0 24 16 VLeft 0
WINDOW 3 24 96 VRight 0
SYMATTR InstName S2
SYMATTR Value Ref
SYMBOL Digital\\diffschmtbuf -32 656 M180
WINDOW 0 32 104 Center 0
WINDOW 3 32 16 Center 0
WINDOW 123 32 -8 Center 0
WINDOW 39 32 -32 Center 0
SYMATTR InstName A6
SYMATTR Value Vt=-0 Vh=0
SYMATTR Value2 Td=50n tripdt=10n
SYMATTR SpiceLine Rout=1k Cout=200p
SYMBOL Digital\\srflop 144 -304 R0
WINDOW 0 0 0 Center 0
WINDOW 3 0 144 Center 0
SYMATTR InstName A7
SYMATTR Value Td=100n tripdt=10n
SYMBOL Digital\\and 144 -32 R180
WINDOW 0 -8 64 Center 0
WINDOW 3 -8 16 Center 0
WINDOW 123 -8 -4 Center 0
WINDOW 39 -8 -29 Center 0
SYMATTR InstName A8
SYMATTR Value Ref=.37
SYMATTR Value2 Td=500n
SYMATTR SpiceLine tripdt=10n
SYMBOL Digital\\and 352 -64 R0
WINDOW 0 0 16 Center 0
WINDOW 3 0 -8 Center 0
WINDOW 123 0 -32 Center 0
SYMATTR InstName A9
SYMATTR Value Tau=5n
SYMATTR Value2 tripdt=5n
SYMBOL Digital\\diffschmtbuf 384 64 M0
WINDOW 0 32 24 Center 0
WINDOW 3 32 112 Center 0
WINDOW 123 32 136 Center 0
SYMATTR InstName A10
SYMATTR Value Vt=8.4 Vh=.1
SYMATTR Value2 Td=50n tripdt=10n
SYMBOL Digital\\diffschmtbuf 384 336 M0
WINDOW 0 32 24 Center 0
WINDOW 3 32 -24 Center 0
WINDOW 123 32 -48 Center 0
SYMATTR InstName A11
SYMATTR Value Vt=8.45 Vh=.25
SYMATTR Value2 Td=50n tripdt=10n
SYMBOL Digital\\diffschmtbuf 384 528 M0
WINDOW 0 32 24 Center 0
WINDOW 3 32 0 Center 0
WINDOW 123 32 -24 Center 0
SYMATTR InstName A12
SYMATTR Value Vt=8.8 Vh=.1
SYMATTR Value2 Td=50n tripdt=10n
SYMBOL Digital\\and 352 656 R0
WINDOW 0 0 16 Center 0
WINDOW 3 0 128 Center 0
WINDOW 123 0 152 Center 0
SYMATTR InstName A13
SYMATTR Value Tau=5n
SYMATTR Value2 tripdt=5n
SYMBOL Digital\\diffschmtbuf 512 -288 R180
WINDOW 0 32 104 Center 0
WINDOW 3 32 16 Center 0
WINDOW 123 32 -8 Center 0
WINDOW 39 32 -32 Center 0
SYMATTR InstName A14
SYMATTR Value Vt=-1.2 Vh=0
SYMATTR Value2 Td=50n tripdt=10n
SYMATTR SpiceLine Rout=1k Cout=300p
SYMBOL sw 544 -16 M180
WINDOW 0 32 80 Left 0
WINDOW 3 32 16 Left 0
SYMATTR InstName S3
SYMATTR Value SH
SYMBOL sw 544 16 R0
WINDOW 0 32 16 Left 0
WINDOW 3 32 80 Left 0
SYMATTR InstName S4
SYMATTR Value SL
SYMBOL sw 544 704 M180
WINDOW 0 32 80 Left 0
WINDOW 3 32 16 Left 0
SYMATTR InstName S5
SYMATTR Value SH
SYMBOL sw 544 736 R0
WINDOW 0 32 16 Left 0
WINDOW 3 32 80 Left 0
SYMATTR InstName S6
SYMATTR Value SL
SYMBOL diode -368 464 R180
WINDOW 0 32 64 Left 0
WINDOW 3 32 0 Left 0
SYMATTR InstName D5
SYMATTR Value Dd
SYMBOL cap -288 400 M0
WINDOW 0 32 0 Left 0
WINDOW 3 32 64 Left 0
WINDOW 39 32 128 Center 0
SYMATTR InstName C4
SYMATTR Value 10p
SYMATTR SpiceLine Rpar=1e6
SYMBOL cap -288 752 M0
WINDOW 0 32 0 Left 0
WINDOW 3 32 64 Left 0
WINDOW 39 32 128 Center 0
SYMATTR InstName C5
SYMATTR Value 10p
SYMATTR SpiceLine Rpar=1e6
SYMBOL cap 608 -320 R0
WINDOW 0 32 0 Left 0
WINDOW 3 32 64 Left 0
WINDOW 39 32 128 Center 0
SYMATTR InstName C6
SYMATTR Value 10p
SYMATTR SpiceLine Rpar=1e6
SYMBOL cap 608 -96 R0
WINDOW 0 32 0 Left 0
WINDOW 3 32 64 Left 0
SYMATTR InstName C7
SYMATTR Value 22p
SYMBOL cap 608 32 R0
WINDOW 0 32 0 Left 0
WINDOW 3 32 64 Left 0
WINDOW 39 32 128 Center 0
SYMATTR InstName C8
SYMATTR Value 27p
SYMATTR SpiceLine Rpar=100k
SYMBOL cap 608 624 R0
WINDOW 0 32 0 Left 0
WINDOW 3 32 64 Left 0
SYMATTR InstName C9
SYMATTR Value 22p
SYMBOL cap 608 752 R0
WINDOW 0 32 0 Left 0
WINDOW 3 32 64 Left 0
WINDOW 39 32 128 Center 0
SYMATTR InstName C10
SYMATTR Value 27p
SYMATTR SpiceLine Rpar=100k
SYMBOL diode -368 688 R180
WINDOW 0 32 64 Left 0
WINDOW 3 32 0 Left 0
SYMATTR InstName D6
SYMATTR Value Dd
SYMBOL diode -368 816 R180
WINDOW 0 32 64 Left 0
WINDOW 3 32 0 Left 0
SYMATTR InstName D7
SYMATTR Value Dd
SYMBOL diode 384 -256 R180
WINDOW 0 32 64 Left 0
WINDOW 3 32 0 Left 0
SYMATTR InstName D8
SYMATTR Value Di
SYMBOL diode 192 688 R180
WINDOW 0 32 64 Left 0
WINDOW 3 32 0 Left 0
SYMATTR InstName D9
SYMATTR Value Di
SYMBOL diode 688 -400 M180
WINDOW 0 32 64 Left 0
WINDOW 3 32 0 Left 0
SYMATTR InstName D10
SYMATTR Value Dd
SYMBOL diode 688 -256 M180
WINDOW 0 32 64 Left 0
WINDOW 3 32 0 Left 0
SYMATTR InstName D11
SYMATTR Value Dd
SYMBOL diode 688 -32 M180
WINDOW 0 32 64 Left 0
WINDOW 3 32 0 Left 0
SYMATTR InstName D12
SYMATTR Value Dd
SYMBOL diode 688 96 M180
WINDOW 0 32 64 Left 0
WINDOW 3 32 0 Left 0
SYMATTR InstName D13
SYMATTR Value Dd
SYMBOL zener 640 304 R180
WINDOW 0 0 64 Right 0
WINDOW 3 0 0 Right 0
SYMATTR InstName D14
SYMATTR Value 220V
SYMBOL zener 720 304 R180
WINDOW 0 0 64 Right 0
WINDOW 3 0 0 Right 0
SYMATTR InstName D15
SYMATTR Value 20Vb
SYMBOL zener 528 432 R180
WINDOW 0 32 64 Left 0
WINDOW 3 32 0 Left 0
SYMATTR InstName D16
SYMATTR Value 10V
SYMBOL zener 608 352 M270
WINDOW 0 36 32 VTop 0
WINDOW 3 -4 32 VBottom 0
SYMATTR InstName D17
SYMATTR Value 210V
SYMBOL zener 720 480 R180
WINDOW 0 0 64 Right 0
WINDOW 3 0 0 Right 0
SYMATTR InstName D18
SYMATTR Value 20V
SYMBOL diode 688 688 M180
WINDOW 0 32 64 Left 0
WINDOW 3 32 0 Left 0
SYMATTR InstName D19
SYMATTR Value Dd
SYMBOL diode 688 816 M180
WINDOW 0 32 64 Left 0
WINDOW 3 32 0 Left 0
SYMATTR InstName D20
SYMATTR Value Dd
TEXT 160 -576 Center 0 ;>> IRS20954 Behavioral Model by analog@ieee.org 8/2006 Rev - <<
TEXT -224 768 Left 0 !.model Di d(Ron=10)\n.model Dd d(Ron=.5 Vfwd=.5)\n.model 10V d(Ron=.5 Vfwd=.5 Vrev=10.4 Roff=12k)\n.model 20V d(Ron=.5 Vfwd=.5 Vrev=20.2 Roff=7k)\n.model 20Vb d(Ron=.5 Vfwd=.5 Vrev=20.2 Roff=22k)\n.model 210V d(Ron=.5 Vfwd=.5 Vrev=210 Roff=5e6)\n.model 220V d(Ron=.5 Vfwd=.5 Vrev=220 Roff=5e6)
TEXT 192 -480 Left 0 !.model SH sw(Vt=.5 Vh=-.5 Ron=5 Ilimit=1.0 Vser=1.2)\n.model SL sw(Vt=.5 Vh=-.5 Ron=3 Ilimit=1.2)
TEXT -264 -160 Left 0 !.model Isw sw\n+ Vt=-.5\n+ Ilimit=200u\n+ Vser=.6
TEXT -128 400 Left 0 !.model Ref sw\n+ Vt=-5.1\n+ Vh=-50m\n+ Vser=1.2\n+ Ron=10
TEXT -80 168 Right 0 ;Deadtime Generator
RECTANGLE Normal 816 928 -496 -560

The netlist it stands for:
* FINAL FILTRO_con_limitador.asc
V2 VDD 0 15
V4 VDD_60 0 60
L1 Vo1 N002 2m
C5 N002 0 1µ
V7 5V 0 5
V8 Vss 0 -5
R9 N031 N008 {R_2}
R10 N001 N031 {R_1}
C3 0 N031 {C_1}
C4 N032 N008 {C_2}
R11 N001 N032 {R_3}
Rp V_error N008 {Rp}
Cp V_error N008 {Cp}
XU4 0 N008 5V Vss V_error TL084  ; pins In+ In- V+ V- OUT
XU5 V_error Vosc 5V Vss Vin LM393  ; pins In+ In- V+ V- OUT
R14 5V Vin 3k
R8 N010 N011 {Rg}
R23 N011 N015 {Rg}
R24 N008 N010 {Rg}
XU3 0 N011 5V Vss N010 TL084  ; pins In+ In- V+ V- OUT
C1 N016 Vo1 22n
Ct1 N019 0 10p
C2 VDD 0 22n
XM1 VDD_60 N021 Vo1 irf510  ; pins D G S
XM2 Vo1 N026 0 irf510  ; pins D G S
RD1 N016 N022 0.1
RG1 N021 N020 22
RG2 N026 N025 22
R3 N012 Vo1 3.5k
R2 N013 N012 6.5k
R1 N016 N013 10k
R5 N024 0 5.4k
R4 N023 N024 4.6k
XX1 VDD Vin N019 0 N023 N024 N027 0 N025 VDD Vo1 N020 N016 N012 irs20954 params: IRS20954
V1 N015 0 0.333
V3 Vt 0 PULSE(-4 4 0 2.5u 2.5u 0 5u)
R12 N002 N003 9k
R13 N003 0 1k
R25 N001 N004 9k
R26 N004 0 1k
R27 A N004 90k
R28 N003 V_limite_C 90k
V5 0 V_limite_C 2.5
Q1 N005 N006 N008 0 BC547B
Q2 Vss A N006 0 BC557B
R29 5V N006 100k
D3 P001 0 NSPW500BS
R30 5V N005 10k
Q3 N007 N005 5V 0 BC557B
R31 N007 P001 1k
C6 N005 5V 100n
D4 N009 A 1N4148
D5 N009 N008 1N750
R32 0 N001 15
R15 N001 N002 0.1
XU6 N003 N004 5V Vss A TL084  ; pins In+ In- V+ V- OUT
D6 Vo1 VDD_60 MUR460
D7 0 Vo1 MUR460
S2 VC N001 N017 0 SW
V10 N017 0 PULSE(0 1 1m 1u 1u 10m 10m 1)
V11 N014 0 40
S3 VC N014 N018 N017 SW
V12 N018 0 1
C8 VC 0 1000µ
D2 N013 VDD_60 BAV21
C9 N021 Vo1 1n
C10 N026 0 1n
D1 VDD N022 1N4448
R7 N027 0 2.5k
R6 VDD N027 7.5k
V6 V+ 0 5
V9 0 V- 5
R33 N030 N029 10k
R34 N029 Vosc 8.45k
C11 Vosc N028 100p
R35 N028 N030 15k
R36 Vosc N028 1Meg
* U7: TLV3501 (symbol AutoGenerated/TLV3501 not available, pins judged from their places): pin1=N029 pin2=0 pin3=V+ pin4=V- pin5=N030 pin6=V-
* U8: OPA365 (symbol AutoGenerated/OPA365 not available, pins judged from their places): pin1=0 pin2=N028 pin3=V+ pin4=V- pin5=Vosc

* block symbol definitions
.subckt irs20954 Vdd In CSD Vss Vref OCset DT Com Lo Vcc Vs Ho Vb CsH
D1 CSD Vdd Dd
D2 Vss CSD Dd
C1 CSD Vss 10p Rpar=1e6
I1 Vdd CSD TBL(1.2 0 1.3 100u)
S1 Vss CSD 0 7 Isw
R1 Vdd 1 30k
R2 2 1 40k
R3 2 Vss 30k
A1 CSD 1 0 0 0 0 6 0 SCHMITT Vt=0 Vh=0 Td=300n tripdt=10n
A2 2 CSD 0 0 0 0 8 0 SCHMITT Vt=0 Vh=0 Td=200n tripdt=10n
D3 In Vdd Dd
D4 Vss In Dd
C2 In Vss 10p
A3 In Vss 0 0 0 4 3 0 SCHMITT Vt=1.9 Vh=0.4 Trise=50n Tfall=2n tripdt=2n
A4 3 5 0 0 0 0 10 0 SCHMITT Vt=0 Vh=0 Td=80n tripdt=5n
A5 4 5 0 0 0 0 11 0 SCHMITT Vt=0 Vh=0 Td=80n tripdt=5n
B1 0 5 I=table(V(DT,Com)/V(Vcc,Com),359m,9m,360m, 7m,569m,7m,570m,5m,889m,5m,890m,3m)
C3 5 0 1n Rpar=100
S2 Vref Vcc Com Vref Ref
A6 OCset Vs 0 0 0 0 12 0 SCHMITT Vt=-0 Vh=0 Td=50n tripdt=10n Rout=1k Cout=200p
A7 8 9 0 0 0 0 7 0 SRFLOP Td=100n tripdt=10n
A8 12 16 15 14 13 9 0 0 AND Ref=.37 Td=500n tripdt=10n
A9 0 10 6 7 14 18 17 0 AND Tau=5n tripdt=5n
A10 Vb Vs 0 0 0 0 14 0 SCHMITT Vt=8.4 Vh=.1 Td=50n tripdt=10n
A11 Vdd Vss 0 0 0 0 15 0 SCHMITT Vt=8.45 Vh=.25 Td=50n tripdt=10n
A12 Vcc Com 0 0 0 0 16 0 SCHMITT Vt=8.8 Vh=.1 Td=50n tripdt=10n
A13 16 6 7 11 0 20 19 0 AND Tau=5n tripdt=5n
A14 Vs CsH 0 0 0 0 13 0 SCHMITT Vt=-1.2 Vh=0 Td=50n tripdt=10n Rout=1k Cout=300p
S3 Ho Vb 17 0 SH
S4 Ho Vs 18 0 SL
S5 Lo Vcc 19 0 SH
S6 Lo Com 20 0 SL
D5 Com Vref Dd
C4 Vref Com 10p Rpar=1e6
C5 OCset Com 10p Rpar=1e6
C6 CsH Vs 10p Rpar=1e6
C7 Vb Ho 22p
C8 Ho Vs 27p Rpar=100k
C9 Vcc Lo 22p
C10 Lo Com 27p Rpar=100k
D6 OCset Vcc Dd
D7 Com OCset Dd
D8 18 13 Di
D9 20 12 Di
D10 CsH Vb Dd
D11 Vs CsH Dd
D12 Ho Vb Dd
D13 Vs Ho Dd
D14 Com Vb 220V
D15 Vs Vb 20Vb
D16 Vss Vdd 10V
D17 Com Vdd 210V
D18 Com Vcc 20V
D19 Lo Vcc Dd
D20 Com Lo Dd
* >> IRS20954 Behavioral Model by analog@ieee.org 8/2006 Rev - <<
.model Di d(Ron=10)
.model Dd d(Ron=.5 Vfwd=.5)
.model 10V d(Ron=.5 Vfwd=.5 Vrev=10.4 Roff=12k)
.model 20V d(Ron=.5 Vfwd=.5 Vrev=20.2 Roff=7k)
.model 20Vb d(Ron=.5 Vfwd=.5 Vrev=20.2 Roff=22k)
.model 210V d(Ron=.5 Vfwd=.5 Vrev=210 Roff=5e6)
.model 220V d(Ron=.5 Vfwd=.5 Vrev=220 Roff=5e6)
.model SH sw(Vt=.5 Vh=-.5 Ron=5 Ilimit=1.0 Vser=1.2)
.model SL sw(Vt=.5 Vh=-.5 Ron=3 Ilimit=1.2)
.model Isw sw
+ Vt=-.5
+ Ilimit=200u
+ Vser=.6
.model Ref sw
+ Vt=-5.1
+ Vh=-50m
+ Vser=1.2
+ Ron=10
* Deadtime Generator
.ends irs20954

.model D D
.lib standard.dio
.model NPN NPN
.model PNP PNP
.lib standard.bjt
* Vb Zos: 220V
* VddZos: 210V
* VccZ: 20.2V
* Vb Z: 20.2V
* VddZ: 10.4V
* Td on: 90ns+Tdt
* Td off: 90ns
* Tsd:  < 1us
* Tr on: 15ns
* Tf off: 10ns
* Tdt: 15/25/35/45ns
* Vdt: .89/.57/.36/.23
* VHin: 2.3
* VLin: 1.5
* VHsat: 1.2
* Ros: 5e6
* Rb: 12k
* Rcc: 7k
* Rdd: 22k
* Rin: 1e6
* UVL Vcc: 8.9/8.7V
* UVL Vb:  8.5/8.3V
* UVL Vdd: 8.7/8.2V
* Io+: 1.0A
* Io-: 1.2A
* Voc: 70/30 %Vdd
* Ioc: +/-100ua
* OCH: 1.2Vos
*  300ns filter
* OCL: 0.0Vos
*  200ns filter
.tran 20m uic
.model MUR460 D(Is=149n Rs=.0384 N=2 EG=1.285 XTI=.5 BV=800
+ IBV=1e-05 Cjo=126.4p Vj=1.34 M=.52 tt=44.4n Iave=4 Vpk=600 mfg=GI type=silicon)
.MODEL BAV21W D  ( IS=1.09u RS=0.105 BV=200 IBV=100n
+ CJO=5.00p  M=0.333 N=3.29 TT=72.0n )
.include LM393.5_1
.include TL084.301
.param Rg=10k
.param R_1=50k R_2=250k R_3=1k C_1=10p C_2=0.15n Rp=200k Cp=1p
.model SW SW(Ron=0.001 Roff=100Meg Vt=0.5 Vh=0.25)
.MODEL BAV21 D  ( IS=1.09u RS=0.105 BV=200 IBV=100n
+ CJO=5.00p  M=0.333 N=3.29 TT=72.0n )
.MODEL 1N4448 D (IS=2.22E-10 N=1.70 BV=1.00E+02 IBV=5.00E-05
+ RS=2.10E-01 CJO=4.00E-12 VJ=.75 M=.333 TT=5.76E-09)
.include irf510.lib.txt
.backanno
.end